# Altium schematic sheet 12V-3V3_Divider.SchDoc
size A4; SheetNumber: 6; SheetTotal: 16
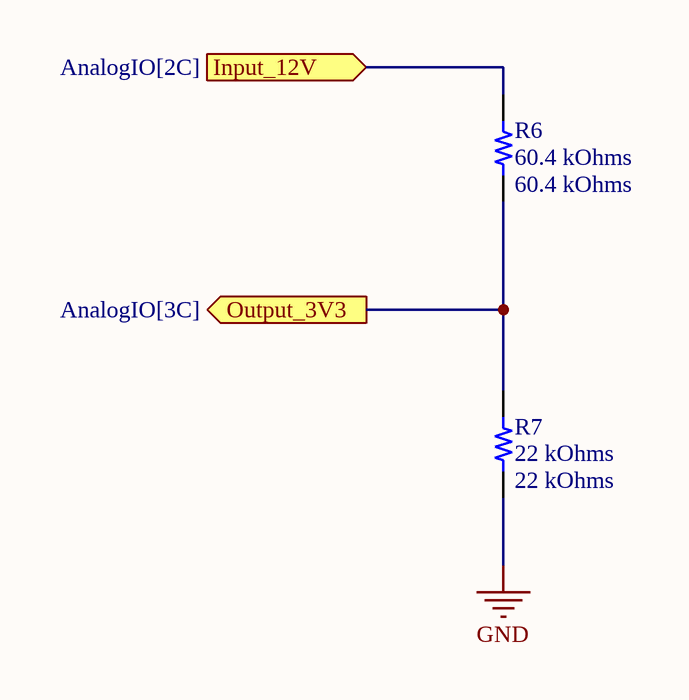
[diagram p0: 12V-3V3_Divider.SchDoc]

## Parts
R6  60.4 kOhms  [RES 0603_1608]
R7  22 kOhms  [RES 0603_1608]

## Ports
Input_12V (in, see AnalogIO[2C]), Output_3V3 (out, see AnalogIO[3C])

## Nets
GND: R7.1
Input_12V: R6.2 ; port Input_12V
Output_3V3: R6.1 R7.2 ; port Output_3V3

## Library data of the parts
R6 = AC0603FR-0760K4L: RES SMD 60.4K OHM 1% 1/10W 0603; Part Number: AC0603FR-0760K4L; Value: 60.4 kOhms
R7 = AC0603FR-7W22KL: RES 22K OHM 1% 1/5W 0603; Part Number: AC0603FR-7W22KL; Value: 22 kOhms